# Altium schematic sheet DRV.SchDoc
size A4; SheetNumber: 4; SheetTotal: 7
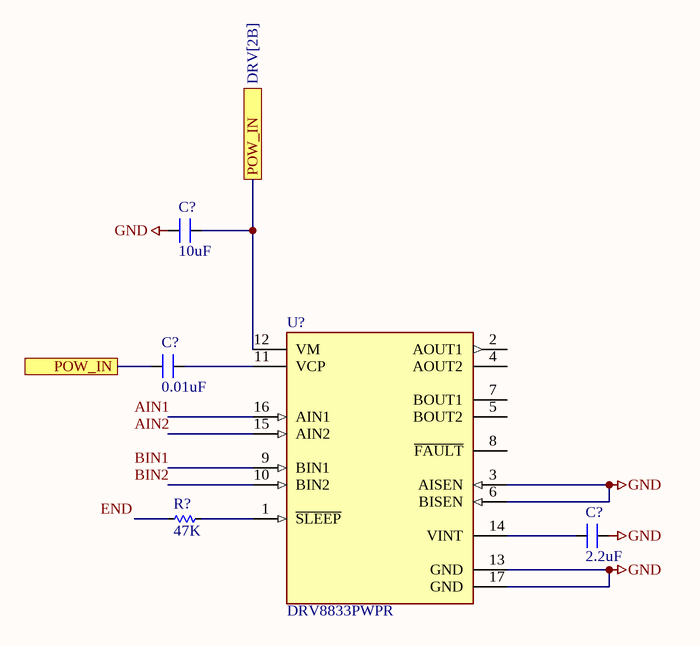
[diagram p0: DRV.SchDoc]

## Parts
(Parts that share a designator on the sheet are numbered #1, #2 ... from top to bottom, then left to right.)
C?#1  10uF  [C-SE-7,5x10x9x5x4]
C?#2  0.01uF  [C-SE-7,5x10x9x5x4]
C?#3  2.2uF  [C-SE-7,5x10x9x5x4]
R?  47K  [RES-1/2W]
U?  DRV8833PWPR  [FP-PWP0016C-IPC_A]

## Ports
POW_IN, POW_IN (see DRV[2B])

## Nets
GND: C?#1.1 C?#3.2 U?.3(AISEN) U?.6(BISEN) U?.13(GND) U?.17(GND)
POW_IN: C?#1.2 C?#2.1 U?.12(VM) ; port POW_IN
NetC?#2_2: C?#2.2 U?.11(VCP)
NetC?#3_1: C?#3.1 U?.14(VINT)
NetR?_1: R?.1 U?.1(~{SLEEP})

Not connected (* = marked no-connect by the designer): R? 2; U? 2(AOUT1) 4(AOUT2) 5(BOUT2) 7(BOUT1) 8(~{FAULT}) 9(BIN1) 10(BIN2) 15(AIN2) 16(AIN1)

## Notes on the sheet
- Labels drawn without touching a wire or pin: AIN1, AIN2, BIN1, BIN2, END

## Library data of the parts
C?#1-C?#3 = CN-SEMI-DIP: Capacitor (Semiconductor SIM Model); Value: 104; LatestRevisionDate: 17-Jul-2002; LatestRevisionNote: Re-released for DXP Platform.; PackageReference: C1206; Publisher: Altium Limited
R? = Res: Manufacturer: Generic Components; Class: Passive; SubClass: R; Published: 08/06/2000; Publisher: Altium Hobart Technology Centre
U? = CMP-1529-00004-3: IC MOTOR DRIVER PAR 16HTSSOP; Supply Current: 3mA; Max Output Current: 2A; Interface: PWM; Output Current: 1.5A; Max Supply Voltage: 10.8V; Fault Protection: Over Temperature; Number of Outputs: 2; Min Supply Voltage: 2.7V; Nominal Supply Current: 3mA; Series: DRV8833; Min Operating Temperature: -40°C; Package Quantity: 2000; Packaging: Tape and Reel; Case/Package: HTSSOP; Output Current per Channel: 1.5A; RoHS Compliant: Yes; RMS Current (Irms): 1.5A; Max Operating Temperature: 85°C; Technology: NMOS; Number of Pins: 16; Radiation Hardening: No; Lead Free: Lead Free; REACH SVHC: No SVHC